# EAGLE design eng (EAGLE 7.4.0)
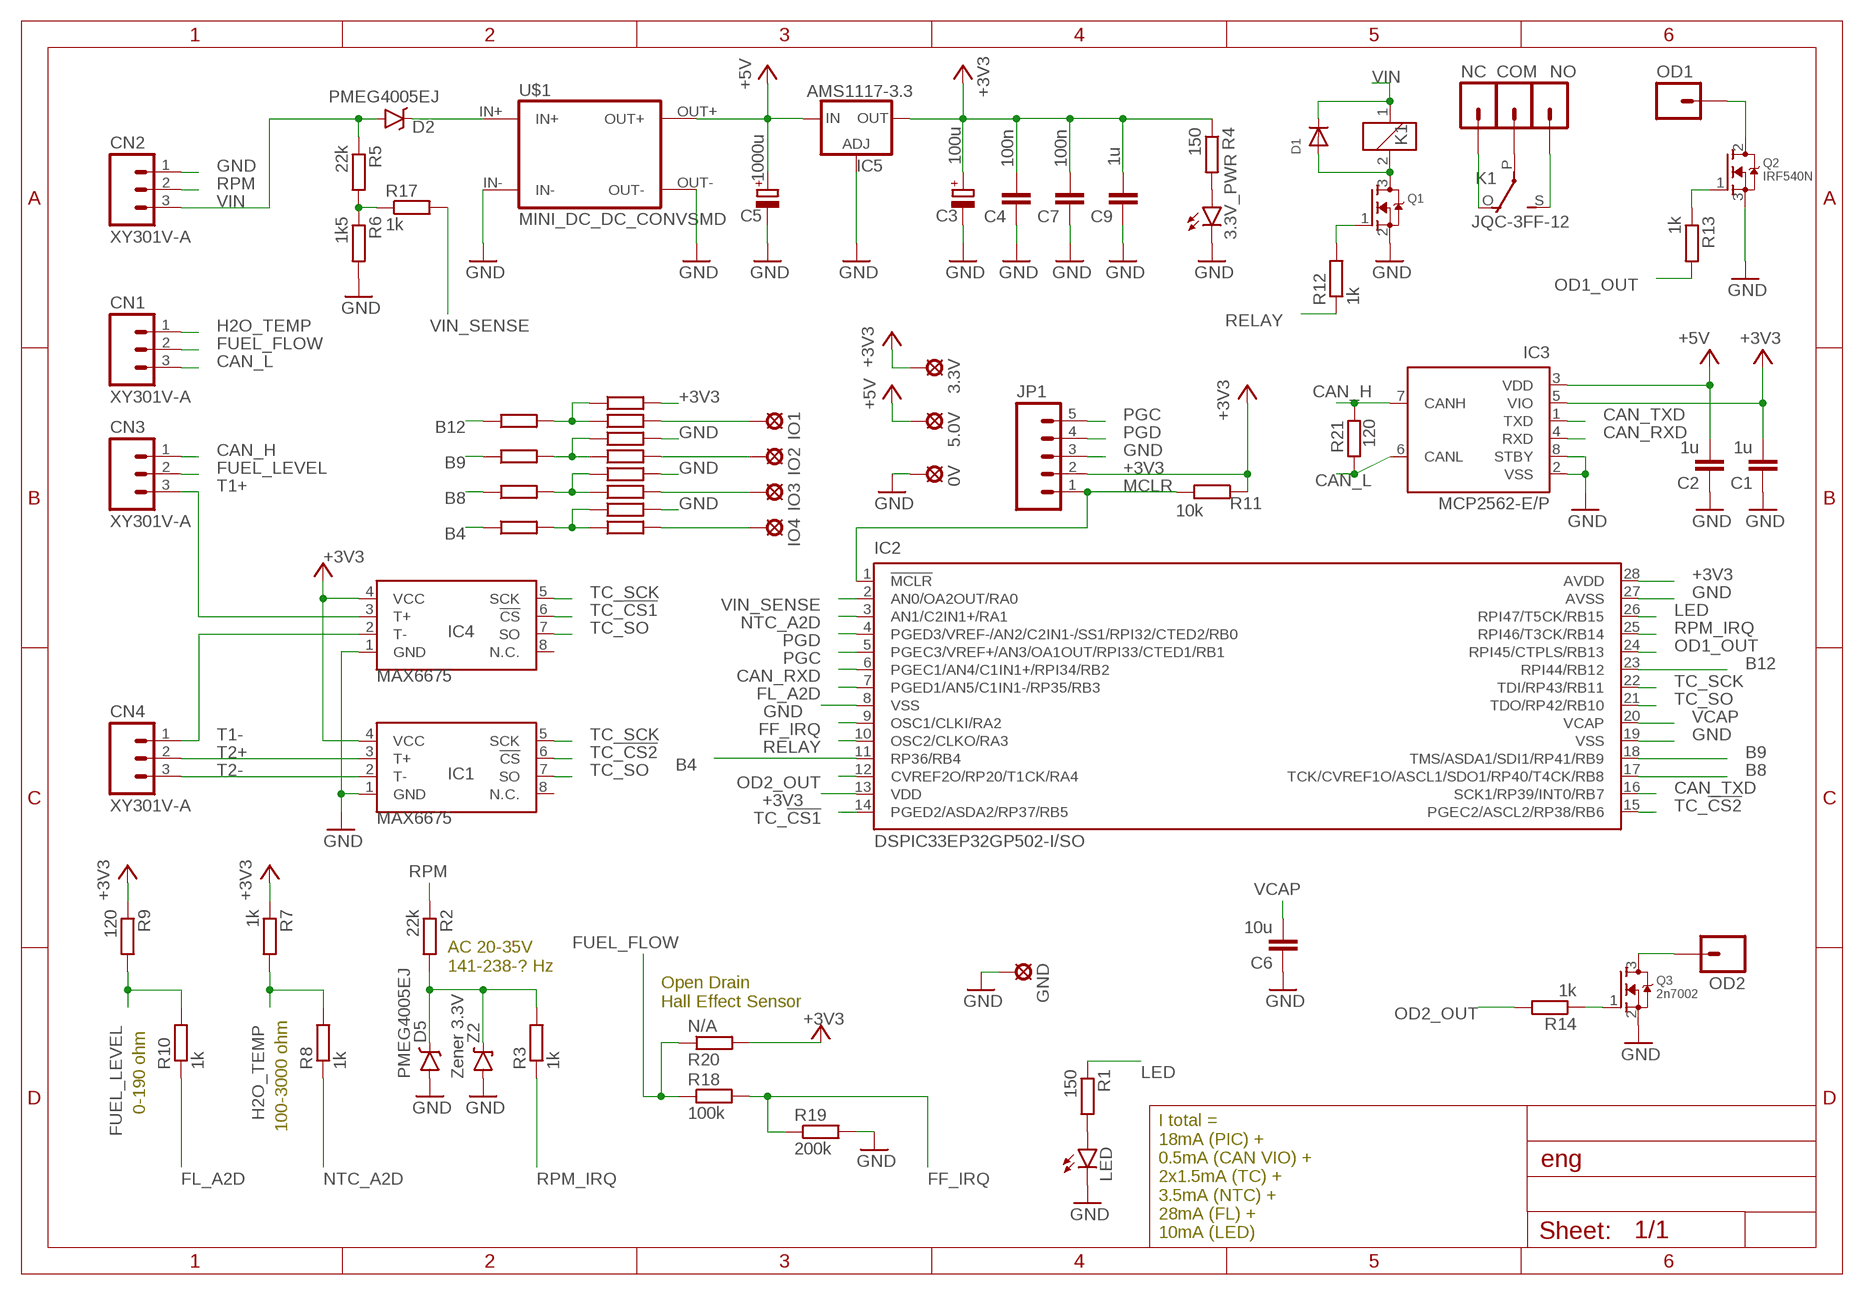
[diagram p0: schematic, sheet 1]

## Parts
0V  LSP10  [LSP10]
3.3V  LSP10  [LSP10]
3.3V_PWR  LED-FKIT-1206  [FKIT-LED-1206]
5.0V  LSP10  [LSP10]
C1  1u  C-EUC0603K  [C0603K]
C2  1u  C-EUC0603K  [C0603K]
C3  100u  CPOL-EUE2.5-7  [E2,5-7]
C4  100n  C-EUC0603K  [C0603K]
C5  1000u  CPOL-EUE3.5-8  [E3,5-8]
C6  10u  C-EUC3225  [C3225]
C7  100n  C-EUC0603K  [C0603K]
C9  1u  C-EUC0603  [C0603]
CN1  XY301V-A  [XY301V-A]
CN2  XY301V-A  [XY301V-A]
CN3  XY301V-A  [XY301V-A]
CN4  XY301V-A  [XY301V-A]
COM  M01PTH_LONGPAD  [1X01_LONGPAD]
D1  DIODESMA  [SMADIODE]
D2  PMEG4005EJ  DIODE-SCHOTTKY-PMEG4005EJ  [SOD-323]
D5  PMEG4005EJ  DIODE-SCHOTTKY-PMEG4005EJ  [SOD-323]
GND  LSP10  [LSP10]
IC1  MAX6675  [SO08]
IC2  DSPIC33EP32GP502-I/SO  [SO28W]
IC3  MCP2562-E/P  [DIL8]
IC4  MAX6675  [SO08]
IC5  AMS1117-3.3  LD117AS33TR  [SOT223]
IO1  LSP10  [LSP10]
IO2  LSP10  [LSP10]
IO3  LSP10  [LSP10]
IO4  LSP10  [LSP10]
JP1  M05PTH  [1X05]
K1  JQC-3FF-12  G5L  [G5LE]
LED  LED-FKIT-1206  [FKIT-LED-1206]
NC  M01PTH_LONGPAD  [1X01_LONGPAD]
NO  M01PTH_LONGPAD  [1X01_LONGPAD]
OD1  M01PTH_LONGPAD  [1X01_LONGPAD]
OD2  M01PTH_LONGPAD  [1X01_LONGPAD]
Q1  MOSFET-NREFLOW  [SOT23]
Q2  IRF540N  MOSFET-NGDS_TO220V  [TO220V]
Q3  2n7002  MOSFET-NREFLOW  [SOT23]
R1  150  R-EU_R0603  [R0603]
R2  22k  R-EU_R0603  [R0603]
R3  1k  R-EU_R0603  [R0603]
R4  150  R-EU_R0603  [R0603]
R5  22k  R-EU_R0603  [R0603]
R6  1k5  R-EU_R0603  [R0603]
R7  1k  R-EU_R0603  [R0603]
R8  1k  R-EU_R0603  [R0603]
R9  120  R-EU_R0603  [R0603]
R10  1k  R-EU_R0603  [R0603]
R11  10k  R-EU_R0603  [R0603]
R12  1k  R-EU_R0603  [R0603]
R13  1k  R-EU_R0603  [R0603]
R14  1k  R-EU_R0603  [R0603]
R15  N/A  R-EU_R0603  [R0603]
R16  N/A  R-EU_R0603  [R0603]
R17  1k  R-EU_R0603  [R0603]
R18  100k  R-EU_R0603  [R0603]
R19  200k  R-EU_R0603  [R0603]
R20  N/A  R-EU_R0603  [R0603]
R21  120  R-EU_R0603  [R0603]
R23  N/A  R-EU_R0603  [R0603]
R24  N/A  R-EU_R0603  [R0603]
R25  N/A  R-EU_R0603  [R0603]
R26  N/A  R-EU_R0603  [R0603]
R29  N/A  R-EU_R0603  [R0603]
R30  N/A  R-EU_R0603  [R0603]
R31  N/A  R-EU_R0603  [R0603]
R32  N/A  R-EU_R0603  [R0603]
R35  N/A  R-EU_R0603  [R0603]
R36  N/A  R-EU_R0603  [R0603]
U$1  MINI_DC_DC_CONVSMD  [DSN-MINI-360-SMD]
Z2  Zener 3.3V  DIODE-ZENERMM  [MINIMELF]

## Nets
+3V3: 3.3V.MP C1.2 C3.+ C4.2 C7.2 C9.2 IC1.4(VCC) IC2.13(VDD) IC2.28(AVDD) IC3.5(VIO) IC4.4(VCC) IC5.2(OUT) IC5.@2(OUT) JP1.2 R4.1 R7.1 R9.1 R11.1 R20.2 R32.2
+5V: 5.0V.MP C2.2 C5.+ IC3.3(VDD) IC5.3(IN) U$1.OUT+
B4: IC2.11(RP36/RB4) R15.1
B8: IC2.17(TCK/CVREF1O/ASCL1/SDO1/RP40/T4CK/RB8) R24.1
B9: IC2.18(TMS/ASDA1/SDI1/RP41/RB9) R23.1
B12: IC2.23(RPI44/RB12) R16.1
CAN_H: CN3.1 IC3.7(CANH) R21.2
CAN_L: CN1.3 IC3.6(CANL) R21.1
CAN_RXD: IC2.6(PGEC1/AN4/C1IN1+/RPI34/RB2) IC3.4(RXD)
CAN_TXD: IC2.16(SCK1/RP39/INT0/RB7) IC3.1(TXD)
FF_IRQ: IC2.9(OSC1/CLKI/RA2) R18.2 R19.1
FL_A2D: IC2.7(PGED1/AN5/C1IN1-/RP35/RB3) R10.1
FUEL_FLOW: CN1.2 R18.1 R20.1
FUEL_LEVEL: CN3.2 R9.2 R10.2
GND: 0V.MP 3.3V_PWR.C C1.1 C2.1 C3.- C4.1 C5.- C6.1 C7.1 C9.1 CN2.1 D5.A GND.MP IC1.1(GND) IC2.8(VSS) IC2.19(VSS) IC2.27(AVSS) IC3.2(VSS) IC3.8(STBY) IC4.1(GND) IC5.1(ADJ) JP1.3 LED.C Q1.2(S) Q2.3(S) Q3.2(S) R6.2 R19.2 R31.2 R35.2 R36.2 U$1.IN- U$1.OUT- Z2.A
H2O_TEMP: CN1.1 R7.2 R8.2
LED: IC2.26(RPI47/T5CK/RB15) R1.1
MCLR: IC2.1(!MCLR!) JP1.1 R11.2
N$1: D1.A K1.2 Q1.3(D)
N$2: Q1.1(G) R12.2
N$3: 3.3V_PWR.A R4.2
N$4: LED.A R1.2
N$5: Q2.1(G) R13.1
N$6: COM.1 K1.P(2:P)
N$7: K1.O(2:O) NC.1
N$8: K1.S(2:S) NO.1
N$9: OD1.1 Q2.2(D)
N$10: OD2.1 Q3.3(D)
N$11: Q3.1(G) R14.1
N$12: R15.2 R25.1 R31.1
N$13: R16.2 R26.1 R32.1
N$14: R5.2 R6.1 R17.1
N$16: R23.2 R29.1 R35.1
N$17: R24.2 R30.1 R36.1
N$18: IO3.MP R30.2
N$19: IO2.MP R29.2
N$22: IO1.MP R26.2
N$23: IO4.MP R25.2
NTC_A2D: IC2.3(AN1/C2IN1+/RA1) R8.1
OD1_OUT: IC2.24(RPI45/CTPLS/RB13) R13.2
OD2_OUT: IC2.12(CVREF2O/RP20/T1CK/RA4) R14.2
PGC: IC2.5(PGEC3/VREF+/AN3/OA1OUT/RPI33/CTED1/RB1) JP1.5
PGD: IC2.4(PGED3/VREF-/AN2/C2IN1-/SS1/RPI32/CTED2/RB0) JP1.4
RELAY: IC2.10(OSC2/CLKO/RA3) R12.1
RPM: CN2.2 R2.1
RPM_IRQ: IC2.25(RPI46/T3CK/RB14) R3.1
RPM_Z: D5.C R2.2 R3.2 Z2.C
T1+: CN3.3 IC4.3(T+)
T1-: CN4.1 IC4.2(T-)
T2+: CN4.2 IC1.3(T+)
T2-: CN4.3 IC1.2(T-)
TC_!CS1: IC2.14(PGED2/ASDA2/RP37/RB5) IC4.6(!CS)
TC_!CS2: IC1.6(!CS) IC2.15(PGEC2/ASCL2/RP38/RB6)
TC_SCK: IC1.5(SCK) IC2.22(TDI/RP43/RB11) IC4.5(SCK)
TC_SO: IC1.7(SO) IC2.21(TDO/RP42/RB10) IC4.7(SO)
VCAP: C6.2 IC2.20(VCAP)
VIN: CN2.3 D1.C D2.A K1.1 R5.1
VIN_D: D2.C U$1.IN+
VIN_SENSE: IC2.2(AN0/OA2OUT/RA0) R17.2
Unconnected: IC1.8(N.C.) IC4.8(N.C.)

## Notes on the sheet
- AC 20-35V
  141-238-? Hz
- Open Drain
  Hall Effect Sensor
- 0-190 ohm
- 100-3000 ohm
- I total =
  18mA (PIC) +
  0.5mA (CAN VIO) + 
  2x1.5mA (TC) + 
  3.5mA (NTC) + 
  28mA (FL) +
  10mA (LED)

## Library data of the parts
0V 3.3V 5.0V GND IO1-IO4 = solpad:LSP10: SOLDER PAD drill 1.0 mm, distributor Buerklin, 12H555
3.3V_PWR LED = SparkFun-LED:LED: LEDs Standard schematic elements and footprints for 5mm, 3mm, 1206, and 0603 sized LEDs. 5mm - Spark Fun Electronics SKU : COM-00529 (and others)
C1 C2 C4 C6 C7 C9 = rcl:C-EU: CAPACITOR, European symbol
C3 C5 = rcl:CPOL-EU: POLARIZED CAPACITOR, European symbol
CN1-CN4 = aliexpress_modules:XY301V-A: 3 Pin Screw Terminal Block Connector 5mm Pitch 5.08-301-3P 301-3P 3pin
COM NC NO OD1 OD2 = SparkFun-Connectors:M01: Header 1 Standard 1-pin 0.1" header. Use with straight break away headers (SKU : PRT-00116), right angle break away headers (PRT-00553), swiss pins (PRT-00743), machine pins (PRT-00117), and female headers (PRT-00115). SMTSO-256-ET is a "flush mount" nut for a 4-40 screw. The older package used to be too tight, and did not allow it to sit properly thru the drill hit. The latest (0.165DIA) fits nice and snug.
D1 = adafruit:DIODE: Diode SMADIODE - SMA Surface Mount Package 20V 1A Schottky Diode Digikey: 641-1014-6-ND DO-1N4148 - Through Hole Small Current Diode SOD-123 20V 1 A (.5mV Vf) Schottky Diode - Digikey: MBRX120TPMSCT-ND SOD-323 10V 570mA (.38mV Vf, 3ns) Schottky Diode - Digikey: ZLLS410CT-ND SOD-523 30V 30mA Schottky Diode (RB751S-40TE61) - Digikey: RB751S-40TE61CT-ND SOT23-R/W - SOT23 Package (R = Solder Paste/Reflow Ovens, W = Hand-Soldering) BAT54Film 40V 300mA - Digikey: 497-7162-1-ND
D2 D5 = SparkFun-DiscreteSemi:DIODE-SCHOTTKY: Schottky diodes in SFE's production catalog BAT20J 1A 23V 0.62Vf RB751 120mA 40V 0.37Vf PMEG4005EJ 0.5A 40V 0.42Vf MBRA140 1A 40V 0.5Vf B340A 3A 40V SMA; PROD_ID: DIO-10955
IC1 IC4 = maxim:MAX6675: Cold-Junction-Compensated K-Thermocouple-to-Digital Converter
IC2 = microchip:DSPIC33EP*502?: 16-Bit Microcontrollers and Digital Signal Controllers with High-Speed PWM, Op Amps and Advanced Analog Source: ww1.microchip.com/downloads/en/DeviceDoc/70000657H.pdf
IC3 = microchip:MCP2562: High-Speed CAN Transceiver Source: http://ww1.microchip.com/downloads/en/DeviceDoc/20005167C.pdf
IC5 = v-reg:LD117A?*: Low drop fixed and adjustable positive voltage regulators 1 A Source: http://www.st.com/stonline/products/literature/ds/7194/ld1117axx.pdf
JP1 = SparkFun-Connectors:M05: Header 5 Standard 5-pin 0.1" header. Use with straight break away headers (SKU : PRT-00116), right angle break away headers (PRT-00553), swiss pins (PRT-00743), machine pins (PRT-00117), and female headers (PRT-00115). Molex polarized connector foot print use with SKU : PRT-08230 with associated crimp pins and housings.
K1 = relay:G5L: RELAY 1 x switch, 10 A/120 V AC, 8 A/30 V ADC, Omron; OC_FARNELL: unknown; OC_NEWARK: unknown
Q1-Q3 = adafruit:MOSFET-N: N-Channel Mosfet 2N7002E - 60V 260mA SOT23 [Digikey: 2N7002ET1GOSTR-ND] - REEL BSH103 - 30V 850mA SOT23 [Digikey: 568-5013-1-ND]
R1-R21 R23-R26 R29-R32 R35 R36 = rcl:R-EU_: RESISTOR, European symbol
U$1 = aliexpress_modules:MINI_DC_DC_CONV: RC Airplane Module Mini 360 DC Buck Converter Step Down Module 4.75V-23V to 1V-17V 17x11x3.8mm New LM2596; $1.06 Input voltage: 4.75V-23V; Output voltage: 1.0V-17V; Current output: peak 3A, 1.8A long time
Z2 = SparkFun-DiscreteSemi:DIODE-ZENER: Zener Diode Production Part - 8199 3.4V Zener Voltage

## Board
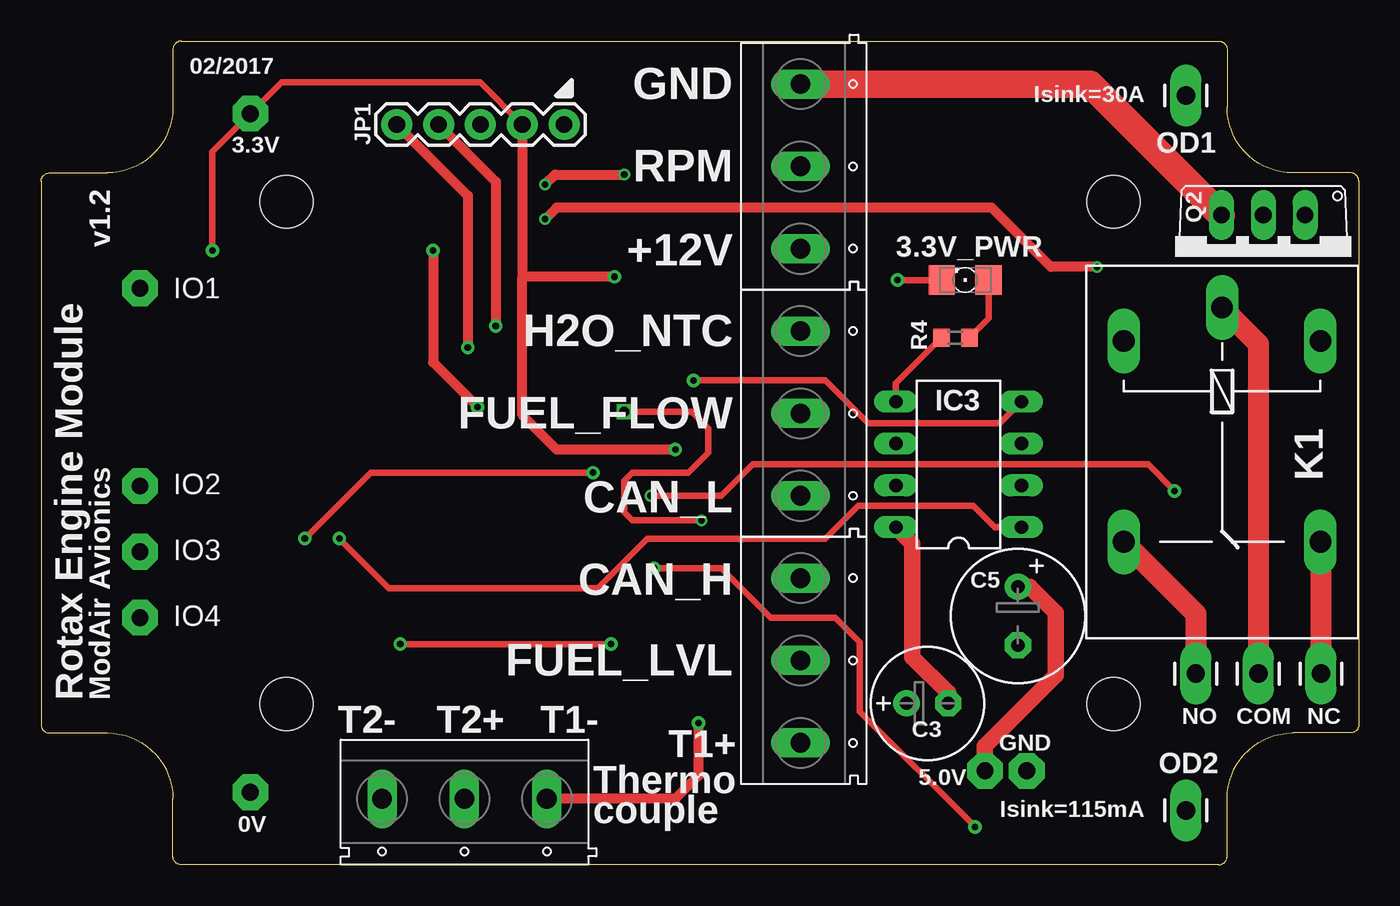
[diagram p1: board, top side]
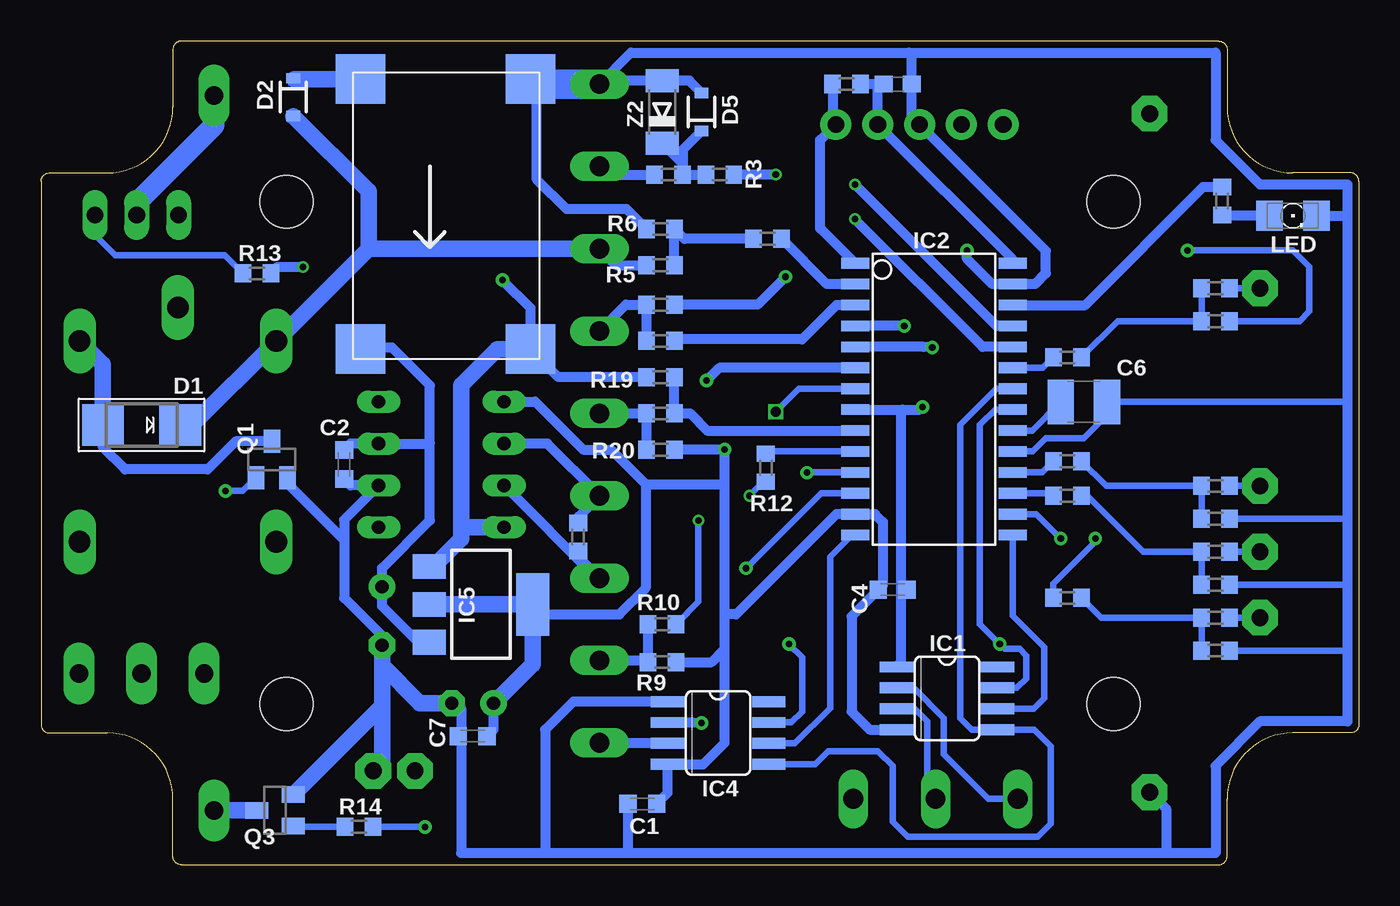
[diagram p2: board, bottom side, seen from below]

Size 80 x 50 mm. Coordinates in mm from the lower left corner, seen from the top.
Outline: 80,41.5 80,8.5 arc-90 79.5,8 76,8 arc90 72,4 72,0.5 arc-90 71.5,0 8.5,0 arc-90 8,0.5 8,4 arc90 4,8 0.5,8 arc-90 0,8.5 0,41.5 arc-90 0.5,42 4,42 arc90 8,46 8,49.5 arc-90 8.5,50 71.5,50 arc-90 72,49.5 72,46 arc90 76,42 79.5,42 arc-90 80,41.5
Copper layers (1*16): Top 0.035mm / dielectric 1.5mm / Bottom 0.035mm
Design rules "ITEAD_DRU_CHECK": minimum track width 6mil, minimum drill 12mil, track to track 6mil, track to pad 6mil, pad to pad 6mil, via to via 6mil, smd to smd 0mil, copper to edge 10mil, drill to drill 10mil, minimum pad ring 10mil, minimum via ring 6mil, stop-mask expansion 2mil, vias tented up to drill 100mil, thermal gap 10mil
Holes 3.2 mm at 14.9,9.75 14.9,40.25 65.1,9.75 65.1,40.25
tKeepout: 16 lines
bKeepout: area 62.6,37.8 to 67.6,42.8; area 62.6,7.2 to 67.6,12.2; area 12.4,7.2 to 17.4,12.2; area 12.4,37.8 to 17.4,42.8
tRestrict: area 12.2,37.5 to 17.6,43; area 62.4,37.5 to 67.8,43; area 62.4,7.1 to 67.8,12.4; area 12.2,7.1 to 17.6,12.4

### Footprints (pad centres in the part's own frame; a part is rotated, then mirrored left to right if it is on the bottom)
LSP10 = drill 1.016 pad 2.159 octagon: MP 0,0
FKIT-LED-1206 = smd 1.6 x 1.803: A -1.422,0; C 1.422,0
C0603K = smd 1.05 x 1.08: 1 -0.875,0; 2 0.875,0
E2,5-7 = drill 0.813 pad 1.6: + -1.27,0 | drill 0.813 pad 1.6 octagon: - 1.27,0
E3,5-8 = drill 0.813 pad 1.6: + -1.778,0 | drill 0.813 pad 1.6 octagon: - 1.778,0
C3225 = smd 1.6 x 2.7: 1 -1.4,0; 2 1.4,0
C0603 = smd 1.1 x 1: 1 -0.85,0; 2 0.85,0
XY301V-A = drill 1.2 long: 1 -5,0; 2 0,0; 3 5,0
1X01_LONGPAD = drill 1.118 pad 1.88 long: 1 0,0
SMADIODE = smd 2.54 x 2.54: A 2.349,0; C -2.349,0
SOD-323 = smd 0.63 x 0.83: A 1.15,0; C -1.15,0
SO08 = smd 0.66 x 2.032: 1 -1.905,-3.073; 2 -0.635,-3.073; 3 0.635,-3.073; 4 1.905,-3.073; 5 1.905,3.073; 6 0.635,3.073; 7 -0.635,3.073; 8 -1.905,3.073
SO28W = smd 0.65 x 1.7: 1 -7.62,-4.78; 2 -6.35,-4.78; 3 -5.08,-4.78; 4 -3.81,-4.78; 5 -2.54,-4.78; 6 -1.27,-4.78; 7 0,-4.78; 8 1.27,-4.78; 9 2.54,-4.78; 10 3.81,-4.78; 11 5.08,-4.78; 12 6.35,-4.78; 13 7.62,-4.78; 14 8.89,-4.78; 15 8.89,4.78; 16 7.62,4.78; 17 6.35,4.78; 18 5.08,4.78; 19 3.81,4.78; 20 2.54,4.78; 21 1.27,4.78; 22 0,4.78; 23 -1.27,4.78; 24 -2.54,4.78; 25 -3.81,4.78; 26 -5.08,4.78; 27 -6.35,4.78; 28 -7.62,4.78
DIL8 = drill 0.813 long: 1 -3.81,-3.81; 2 -1.27,-3.81; 3 1.27,-3.81; 4 3.81,-3.81; 5 3.81,3.81; 6 1.27,3.81; 7 -1.27,3.81; 8 -3.81,3.81
SOT223 = smd 1.5 x 2: 1 -2.3,-3.15; 2 0,-3.15; 3 2.3,-3.15 | smd 3.8 x 2: @2 0,3.15
1X05 = drill 1.016 pad 1.88: 1 0,0; 2 2.54,0; 3 5.08,0; 4 7.62,0; 5 10.16,0
G5LE = drill 1.321 long: 1 -7.493,-5.969; 2 -7.493,5.969; O 4.699,5.969; P -9.525,0; S 4.699,-5.969
SOT23 = smd 1 x 1.4: 1 -0.95,-1.1; 2 0.95,-1.1; 3 0,1.1
TO220V = drill 1.016 long: 1 -2.54,-2.54; 2 0,-2.54; 3 2.54,-2.54
R0603 = smd 1 x 1.1: 1 -0.85,0; 2 0.85,0
DSN-MINI-360-SMD = smd 3 x 3: IN+ 8.3,5.2; IN- 8.3,-5.1; OUT+ -8.1,5.2; OUT- -8.1,-5.1
MINIMELF = smd 1.4 x 2: A 1.9,0; C -1.9,0

### Placement (x,y rotation side)
0V  12.7,4.4 0 top
3.3V  12.7,45.6 180 top
3.3V_PWR  56.1,35.5 180 top
5.0V  57.3,5.7 0 top
C1  43.5,3.7 0 bottom
C2  61.6,24.3 90 bottom
C3  53.8,9.8 0 top
C4  28.3,16.7 180 bottom
C5  59.3,15.1 270 top
C6  16.7,28.1 180 bottom
C7  53.8,7.8 0 bottom
C9  28,47.4 180 bottom
CN1  46.1,27.4 270 top
CN2  46.1,42.4 270 top
CN3  46.1,12.4 270 top
CN4  25.7,4 180 top
COM  73.9,11.6 0 top
D1  73.9,26.7 180 bottom
D2  64.7,46.6 270 bottom
D5  39.9,45.7 90 bottom
GND  59.84,5.7 0 top
IC1  25,10.1 270 bottom
IC2  25.8,28.9 270 bottom
IC3  55.7,24.3 90 top
IC4  38.9,8 270 bottom
IC5  53.3,15.8 270 bottom
IO1  6,35 0 top
IO2  6,23 0 top
IO3  6,19 0 top
IO4  6,15 0 top
JP1  31.75,44.94 180 top
K1  71.7,24.3 270 top
LED  4,39.4 0 bottom
NC  77.7,11.6 0 top
NO  70.1,11.6 0 top
OD1  69.5,46.7 0 top
OD2  69.5,3.3 0 top
Q1  66,24.6 0 bottom
Q2  74.2,36.9 180 top
Q3  65.8,3.3 90 bottom
R1  8.3,40.3 270 bottom
R2  41.9,41.9 0 bottom
R3  38.8,41.9 180 bottom
R4  55.5,32 0 top
R5  42.4,36.4 0 bottom
R6  42.4,38.6 180 bottom
R7  42.4,34 180 bottom
R8  42.4,31.8 180 bottom
R9  42.3,12.3 180 bottom
R10  42.3,14.6 180 bottom
R11  31.1,47.4 180 bottom
R12  36,24.1 270 bottom
R13  66.9,35.9 0 bottom
R14  60.7,2.3 0 bottom
R15  17.7,16.2 0 bottom
R16  17.7,30.8 0 bottom
R17  35.9,38 0 bottom
R18  42.4,27.4 0 bottom
R19  42.4,29.6 180 bottom
R20  42.4,25.2 0 bottom
R21  47.4,19.9 270 bottom
R23  17.7,24.5 0 bottom
R24  17.7,22.4 0 bottom
R25  8.7,15 0 bottom
R26  8.7,35 0 bottom
R29  8.7,23 0 bottom
R30  8.7,19 0 bottom
R31  8.7,13 0 bottom
R32  8.7,33 0 bottom
R35  8.7,21 0 bottom
R36  8.7,17 0 bottom
U$1  55.4,39.4 90 bottom
Z2  42.3,45.7 90 bottom

### Tracks (layer width: path | path; a pad name or v marks a point on that pad's centre or on a via)
+3V3  (via drill 0.4 pad 0.81)
  Top 0.406: IC3.5 51.89,29.24 R4.1 | v10.4,37.3 10.4,43.3 3.3V.MP 14.6,47.5 26.65,47.5 JP1.2
  Top 0.61: JP1.2 29.21,35.7 | v34.8,35.7 29.21,35.7 | v38.5,25.2 31.3,25.2 29.21,27.29 29.21,35.7
  Bottom 0.406: v10.4,37.3 4,37.3 3,36.3 3,33.6 3.6,33 R32.2
  Bottom 0.61: C7.2 52.53,8.2 C3.+ | JP1.2 | JP1.2 29.21,47.04 C9.2 R11.1 | R9.1 39.3,12.3 38.5,13.1 | C1.2 41.97,4.35 IC4.4 39.8,6.09 38.5,7.4 38.5,13.1 | IC1.4 29.7,8.2 30.8,9.3 30.8,15.07 C4.2 28.9,16.98 28.9,20.8 29.38,21.28 IC2.13 31.72,21.28 37.8,15.2 38.4,15.2 38.5,15.1 | IC3.5 50.01,28.11 47.1,25.2 45.4,25.2 43.3,23.1 | 43.3,23.1 43.3,16.8 44.9,15.2 49.55,15.2 IC5.@2 | R20.2 v38.5,25.2 38.5,23.2 | 38.5,13.1 38.5,15.1 | 38.5,15.1 38.5,23.2 | 43.3,23.1 38.6,23.1 38.5,23.2 | v34.8,35.7 36.5,34 R7.1 | IC2.28 21.02,36.75 JP1.2
  Bottom 1.016: C3.+ 50.15,12.18 IC5.@2 IC5.2
+5V
  Top 1.016: C5.+ 60.02,16.88 61.6,15.3 61.6,11.5 57.3,7.2 5.0V.MP
  Bottom 0.61: 60.4,31.1 U$1.OUT+ 60.5,31.4 58.7,31.4 56.4,29.1 56.4,25.6 | 56.4,25.6 56.4,20.9 59.3,18 C5.+ 59.3,15.7 57.1,13.5 IC5.3 | 56.4,25.6 56.43,25.57 IC3.3 61.2,25.57 C2.2
B4  (via drill 0.4 pad 0.81)
  Top 0.406: v33.5,23.8 20,23.8 v16,19.8
  Bottom 0.406: IC2.11 33.48,23.82 v33.5,23.8 | v16,19.8 16,19.6 18.55,17.05 R15.1
B8
  Bottom 0.406: IC2.17 18.7,22.55 R24.1
B9
  Bottom 0.406: IC2.18 19.23,23.82 R23.1
B12
  Bottom 0.406: IC2.23 19.18,30.17 R16.1
CAN_H
  Bottom 0.61: IC3.7 46.26,17.4 CN3.1 47.4,18.7 R21.2
CAN_L
  Bottom 0.61: R21.1 47.4,21.1 CN1.3 49.27,25.57 IC3.6
CAN_RXD  (via drill 0.4 pad 0.81)
  Top 0.406: v39.6,29.4 47.6,29.4 50.2,26.8 58.2,26.8 IC3.4
  Bottom 0.61: IC2.6 38.83,30.17 v39.6,29.4
CAN_TXD  (via drill 0.4 pad 0.81)
  Top 0.406: v18.1,19.8 21.1,16.8 33.8,16.8 36.8,19.8 47.6,19.8 49.6,21.8 56.6,21.8 57.9,20.5 IC3.1
  Bottom 0.406: 20.98,21.28 19.58,21.28 v18.1,19.8
  Bottom 0.61: 20.98,21.28 IC2.16
FF_IRQ
  Bottom 0.61: R19.1 R18.2 40.6,27.4 39.56,26.36 IC2.9
FL_A2D  (via drill 0.4, 0.6)
  Top 0.406: v35.4,27.5 39.5,27.5 40.5,26.5 40.5,25 39.3,23.8 35.9,23.8 35.4,23.3 35.4,21.4 35.9,20.9 v40.1,20.9
  Bottom 0.406: R10.1 40.1,15.95 v40.1,20.9 | v35.4,27.5 34,28.9 IC2.7
FUEL_FLOW
  Bottom 0.61: R20.1 R18.1 CN1.2
FUEL_LEVEL
  Bottom 0.61: CN3.2 43.25,12.4 R9.2 R10.2
GND  (via drill 0.4 pad 0.81)
  Top 0.406: 3.3V_PWR.C v52,35.5
  Top 0.61: v23.8,37.3 23.8,30.5 v26.5,27.8
  Top 1.016: C3.- 55.07,10.43 52.9,12.6 52.9,19.48 IC3.8
  Top 1.676: Q2.3 63.7,47.4 CN2.1
  Bottom 0.406: R31.2 0.7,13 | R36.2 0.7,17 | R35.2 0.7,21 | IC2.19 19.8,25.1 19,25.9 16.7,25.9 15.3,27.3 C6.1 0.7,28.1
  Bottom 0.61: 27.3,49.3 8.7,49.3 8.7,44 6,41.3 0.7,41.3 0.7,39.4 | 0.7,39.4 0.7,28.1 0.7,21 0.7,17 0.7,13 0.7,8.7 6,8.7 8.7,6 8.7,0.7 11.7,0.7 | 11.7,0.7 39.4,0.7 | 39.4,0.7 44.3,0.7 | 44.3,0.7 49.5,0.7 | 49.5,0.7 54.5,0.7 54.5,7.62 | LED.C 0.7,39.4 | D5.A 40.65,47.6 Z2.A 45.9,47.6 CN2.1 44.2,49.3 27.3,49.3 | R6.2 44.45,39.8 48.1,39.8 49.9,41.6 49.9,47.4 | C2.1 61.2,23.03 IC3.2 61.6,20.94 61.6,19.7 | 54.5,7.62 54.5,9.5 54.8,9.8 C3.- | 59.3,12.8 59.3,12.1 | IC3.8 | C7.1 54.5,7.62 | v52,35.5 50.3,33.8 U$1.OUT- 48.6,29.6 R19.2 | IC5.1 56.2,18.1 | 61.6,19.7 61.6,16.2 59.3,13.9 C5.- | 39.38,0.73 39.4,0.7 | IC4.1 47.7,9.9 49.4,8.2 49.4,0.8 49.5,0.7 | C1.1 44.38,0.77 44.3,0.7 | 27.8,16.32 27.8,27.53 27.7,27.63 | 27.8,16.32 27.8,12.28 IC1.1 | C4.1 27.8,16.32 | 27.3,49.3 27.15,49.15 C9.1 27.15,45.42 JP1.3 19,37.27 19,35.9 19.65,35.25 IC2.27 22.25,35.25 23.8,36.8 v23.8,37.3 | IC2.8 27.7,27.63 | 27.7,27.63 26.67,27.63 v26.5,27.8 | Q1.2 65.05,23.15 61.6,19.7 | 0V.MP 11.7,3.4 11.7,0.7
  Bottom 1.016: 54.5,20.5 54.5,29.1 52.3,31.3 U$1.OUT- | 59.3,12.1 57,9.8 C3.- | IC3.8 54.5,20.5 | 54.5,20.5 54.5,19.8 56.2,18.1 | Q3.2 59.3,9.65 | 59.3,9.65 59.3,12.8 C5.- | GND.MP 59.3,6.24 59.3,9.65
  Bottom 1.778: CN2.1 49.9,47.4 50.3,47.4 U$1.IN-
H2O_TEMP
  Bottom 0.61: R8.2 R7.2 44.5,34 CN1.1
LED
  Bottom 0.61: IC2.26 16.62,33.98 9.45,41.15 R1.1
MCLR
  Bottom 0.61: R11.2 31.95,45.14 JP1.1 32.7,43.99 32.7,38.64 IC2.1
N$1
  Bottom 0.61: Q1.3 68.2,25.7 69.9,24 74.9,24 76.25,25.35 D1.A
  Bottom 1.016: D1.A 76.25,30.37 K1.2
N$2  (via drill 0.4, 0.4 pad 0.81)
  Top 0.406: v68.8,22.7 67.2,24.3 43.2,24.3 41.3,22.4 v37,22.4
  Bottom 0.406: 36.35,23.25 R12.2 36.15,23.25 v37,22.4 | v68.8,22.7 67.75,22.7 Q1.1
N$3
  Top 0.406: R4.2 57.52,33.17 3.3V_PWR.A
N$4
  Bottom 0.61: LED.A 8.25,39.4 R1.2
N$5
  Bottom 0.406: R13.1 68.85,37 75.5,37 76.74,38.24 Q2.1
N$6
  Top 1.27: K1.P 73.9,31.62 COM.1
N$7
  Top 1.27: K1.O 77.7,19.57 NC.1
N$8
  Top 1.27: K1.S 70.1,15.23 NO.1
N$9
  Bottom 1.27: Q2.2 74.2,40.2 69.5,44.9 OD1.1
N$10
  Bottom 1.016: Q3.3 OD2.1
N$11
  Bottom 0.406: Q3.1 64.65,2.3 R14.1
N$12
  Bottom 0.406: R31.1 R25.1 15.65,15 R15.2
N$13
  Bottom 0.406: R26.1 R32.1 14.65,33 R16.2
N$14
  Bottom 0.61: R17.1 40.95,38 R6.1 R5.2
N$16
  Bottom 0.406: R35.1 R29.1 15.35,23 R23.2
N$17
  Bottom 0.406: R36.1 R30.1 13.1,19 16.5,22.4 R24.2
N$18
  Bottom 0.406: IO3.MP R30.2
N$19
  Bottom 0.406: R29.2 IO2.MP
N$22
  Bottom 0.406: IO1.MP R26.2
N$23
  Bottom 0.406: IO4.MP R25.2
NTC_A2D
  Bottom 0.61: IC2.3 31.72,33.98 33.8,31.9 41.45,31.9 R8.1
OD1_OUT  (via drill 0.4)
  Top 0.61: v64.1,36.3 61.3,36.3 57.7,39.9 31.3,39.9 v30.6,39.2
  Bottom 0.61: IC2.24 22.84,31.44 v30.6,39.2 | R13.2 65.65,36.3 v64.1,36.3
OD2_OUT  (via drill 0.4 pad 0.81)
  Top 0.406: v37.2,18 41.3,18 44.3,15 48.2,15 49.7,13.5 49.7,9.3 v56.7,2.3
  Bottom 0.406: v56.7,2.3 R14.2 | IC2.12 32.65,22.55 v37.2,18
PGC  (via drill 0.4 pad 0.81)
  Top 0.61: JP1.5 25.9,40.63 v25.9,31.4
  Bottom 0.61: v25.9,31.4 26.44,31.44 IC2.5
PGD  (via drill 0.4 pad 0.81)
  Top 0.61: JP1.4 27.6,41.47 v27.6,32.7
  Bottom 0.61: v27.6,32.7 v27.61,32.71 IC2.4
RELAY
  Bottom 0.406: IC2.10 35.86,25.09 R12.1
RPM
  Bottom 0.61: CN2.2 45.6,41.9 R2.1
RPM_IRQ  (via drill 0.4)
  Top 0.61: v30.6,41.3 31.2,41.9 v35.4,41.9
  Bottom 0.61: IC2.25 22.01,32.71 v30.6,41.3 | v35.4,41.9 R3.1
RPM_Z
  Bottom 0.61: R2.2 41.05,42.55 Z2.C | D5.C 41.05,43.4 R2.2 | R2.2 R3.2
T1+
  Bottom 0.61: IC4.3 46.06,7.36 CN3.3
T1-  (via drill 0.4 pad 0.81)
  Top 0.61: v39.9,8.6 39.9,5.4 38.5,4 CN4.1
  Bottom 0.61: IC4.2 40.47,8.64 v39.9,8.6
T2+
  Bottom 0.406: IC1.3 26.96,9.46 26.2,8.7 26.2,4.5 CN4.2
T2-
  Bottom 0.406: IC1.2 27.04,10.73 25.2,8.9 25.2,6.7 22.5,4 CN4.3
TC_!CS1
  Bottom 0.406: IC4.6 34.23,7.36 32.1,9.5 32.1,18.7 30.79,20.01
  Bottom 0.61: 30.79,20.01 IC2.14
TC_!CS2
  Bottom 0.406: IC1.6 19.73,9.46 19.1,10.1 19.1,13.2 21,15.1 21,19.99 IC2.15
TC_SCK
  Bottom 0.406: IC2.22 22,28.9 24.2,26.7 24.2,8.9 23.5,8.2 IC1.5 19.7,8.2 18.7,7.2 18.7,2.5 19.5,1.7 27.4,1.7 28.3,2.6 28.3,6 29.2,6.9 32.2,6.9 33.01,6.09 IC4.5
TC_SO  (via drill 0.4 pad 0.81)
  Top 0.406: v34.6,13.4 v21.8,13.4
  Bottom 0.406: IC4.7 34.47,8.64 33.8,9.3 33.8,12.6 v34.6,13.4 | IC2.21 22.07,27.63 23,26.7 23,14.6 v21.8,13.4 21.65,13.25 21.5,13.1 20.6,13.1 20.2,12.7 20.2,11.3 20.77,10.73 IC1.7
VCAP
  Bottom 0.406: IC2.20 19.84,26.36 C6.2
VIN
  Bottom 0.61: CN2.3 45.1,36.4 R5.1
  Bottom 1.016: D1.C 70.82,26.7 K1.1 60.12,37.4 | 60.12,37.4 CN2.3 | D2.A 60.12,40.87 60.12,37.4
VIN_D
  Bottom 0.61: 64.65,47.7 D2.C
  Bottom 1.016: 64.65,47.7 U$1.IN+
VIN_SENSE
  Bottom 0.61: IC2.2 32.3,35.25 R17.2

### Text on the board
tPlace: 02/2017 | GND | Isink=30A | RPM | +12V | v1.2 | H2O_NTC | FUEL_FLOW | CAN_L | CAN_H | FUEL_LVL | Rotax Engine Module | ModAir Avionics | T2- | T2+ | T1- | T1+ | Isink=115mA | Thermo / couple
Document: Copper to Edge: >0.3mm | Outline Dimension Accuracy: +- 0.2mm | Bottom Extrude: Max 4.5mm | Top Extrude: Max 16.9mm